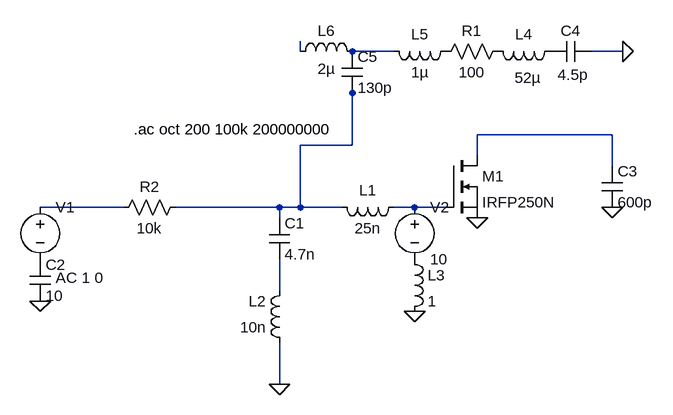
[diagram p0: schematic Draft2.asc]
Draft2.asc, the LTspice schematic file:
Version 4
SHEET 1 880 680
WIRE 112 -16 112 -32
WIRE 256 -16 192 -16
WIRE 608 -16 560 -16
WIRE 192 48 192 32
WIRE 592 112 384 112
WIRE 192 128 192 48
WIRE 192 128 112 128
WIRE 384 144 384 112
WIRE 592 160 592 112
WIRE -160 224 -288 224
WIRE 80 224 -80 224
WIRE 112 224 112 128
WIRE 112 224 80 224
WIRE 176 224 112 224
WIRE 288 224 256 224
WIRE 336 224 288 224
WIRE 80 240 80 224
WIRE 80 352 80 304
WIRE 80 496 80 432
FLAG 384 240 0
FLAG -288 368 0
FLAG 288 384 0
FLAG 592 224 0
FLAG 608 -16 0
FLAG 80 496 0
SYMBOL nmos 336 144 R0
SYMATTR InstName M1
SYMATTR Value IRFP250N
SYMBOL ind 272 208 R90
WINDOW 0 5 56 VBottom 2
WINDOW 3 32 56 VTop 2
SYMATTR InstName L1
SYMATTR Value 25n
SYMATTR SpiceLine Rser=.02
SYMBOL voltage -288 208 R0
WINDOW 123 24 124 Left 2
WINDOW 39 0 0 Left 0
SYMATTR Value2 AC 1 0
SYMATTR InstName V1
SYMATTR Value ""
SYMBOL voltage 288 208 R0
WINDOW 123 0 0 Left 0
WINDOW 39 0 0 Left 0
SYMATTR InstName V2
SYMATTR Value 10
SYMBOL cap -304 304 R0
SYMATTR InstName C2
SYMATTR Value 10
SYMBOL ind 272 288 R0
SYMATTR InstName L3
SYMATTR Value 1
SYMATTR SpiceLine Rser=10000
SYMBOL cap 576 160 R0
SYMATTR InstName C3
SYMATTR Value 600p
SYMBOL cap 560 -32 R90
WINDOW 0 0 32 VBottom 2
WINDOW 3 36 28 VTop 2
SYMATTR InstName C4
SYMATTR Value 4.5p
SYMBOL ind 512 -32 R90
WINDOW 0 5 56 VBottom 2
WINDOW 3 41 50 VTop 2
SYMATTR InstName L4
SYMATTR Value 52µ
SYMBOL res 432 -32 R90
WINDOW 0 0 56 VBottom 2
WINDOW 3 32 56 VTop 2
SYMATTR InstName R1
SYMATTR Value 100
SYMBOL ind 352 -32 R90
WINDOW 0 5 56 VBottom 2
WINDOW 3 32 56 VTop 2
SYMATTR InstName L5
SYMATTR Value 1µ
SYMBOL cap 176 -16 R0
SYMATTR InstName C5
SYMATTR Value 130p
SYMATTR SpiceLine Rser=.01
SYMBOL cap 64 240 R0
SYMATTR InstName C1
SYMATTR Value 4.7n
SYMATTR SpiceLine Rser=.01
SYMBOL ind 96 448 R180
WINDOW 0 36 80 Left 2
WINDOW 3 36 40 Left 2
SYMATTR InstName L2
SYMATTR Value 10n
SYMBOL ind 96 0 R270
WINDOW 0 32 56 VTop 2
WINDOW 3 5 56 VBottom 2
SYMATTR InstName L6
SYMATTR Value 2µ
SYMATTR SpiceLine Rser=150m
SYMBOL res -64 208 R90
WINDOW 0 0 56 VBottom 2
WINDOW 3 32 56 VTop 2
SYMATTR InstName R2
SYMATTR Value 10k
TEXT -144 104 Left 2 !.ac oct 200 100k 200000000

The netlist it stands for:
* Draft2.asc
M1 N004 N006 0 0 IRFP250N
L1 N006 N003 25n Rser=.02
V1 N005 P001 AC 1 0
V2 N006 P002 10
C2 P001 0 10
L3 P002 0 1 Rser=10000
C3 N004 0 600p
C4 0 P003 4.5p
L4 P003 P004 52µ
R1 P004 P005 100
L5 P005 N002 1µ
C5 N002 N003 130p Rser=.01
C1 N003 N007 4.7n Rser=.01
L2 0 N007 10n
L6 N001 N002 2µ Rser=150m
R2 N003 N005 10k
.model NMOS NMOS
.model PMOS PMOS
.lib standard.mos
.ac oct 200 100k 200000000
.backanno
.end